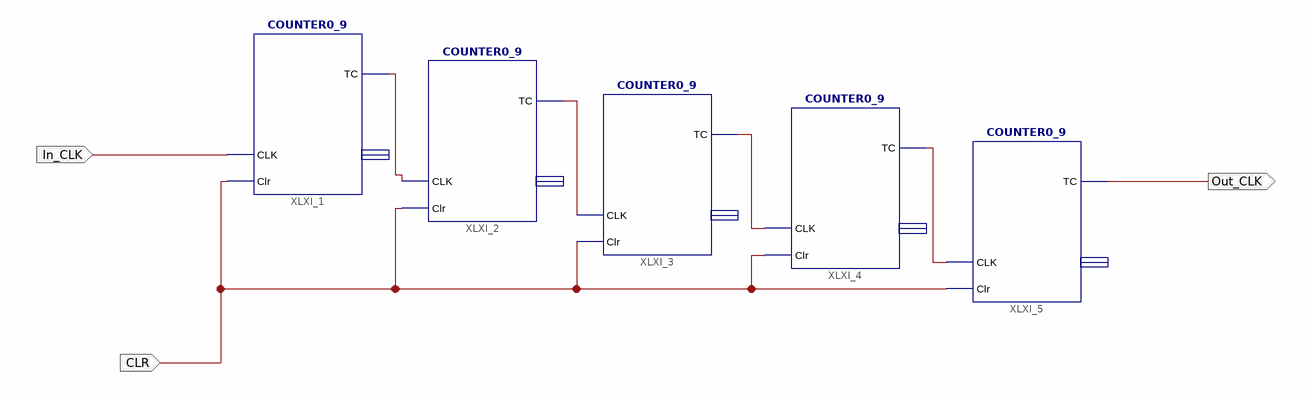
[diagram p0: schematic sheet 1]
// Xilinx ISE schematic Div100k.sch (spartan6) as structural Verilog: 5 symbols, 3 ports
module Div100k (
  input  In_CLK,
  input  CLR,
  output Out_CLK
);

  wire XLXN_1, XLXN_2, XLXN_3, XLXN_11;

  COUNTER0_9 XLXI_1 (.CLK(In_CLK), .Clr(CLR), .TC(XLXN_1));  // open: bit
  COUNTER0_9 XLXI_2 (.CLK(XLXN_1), .Clr(CLR), .TC(XLXN_2));  // open: bit
  COUNTER0_9 XLXI_3 (.CLK(XLXN_2), .Clr(CLR), .TC(XLXN_3));  // open: bit
  COUNTER0_9 XLXI_4 (.CLK(XLXN_3), .Clr(CLR), .TC(XLXN_11));  // open: bit
  COUNTER0_9 XLXI_5 (.CLK(XLXN_11), .Clr(CLR), .TC(Out_CLK));  // open: bit
endmodule
